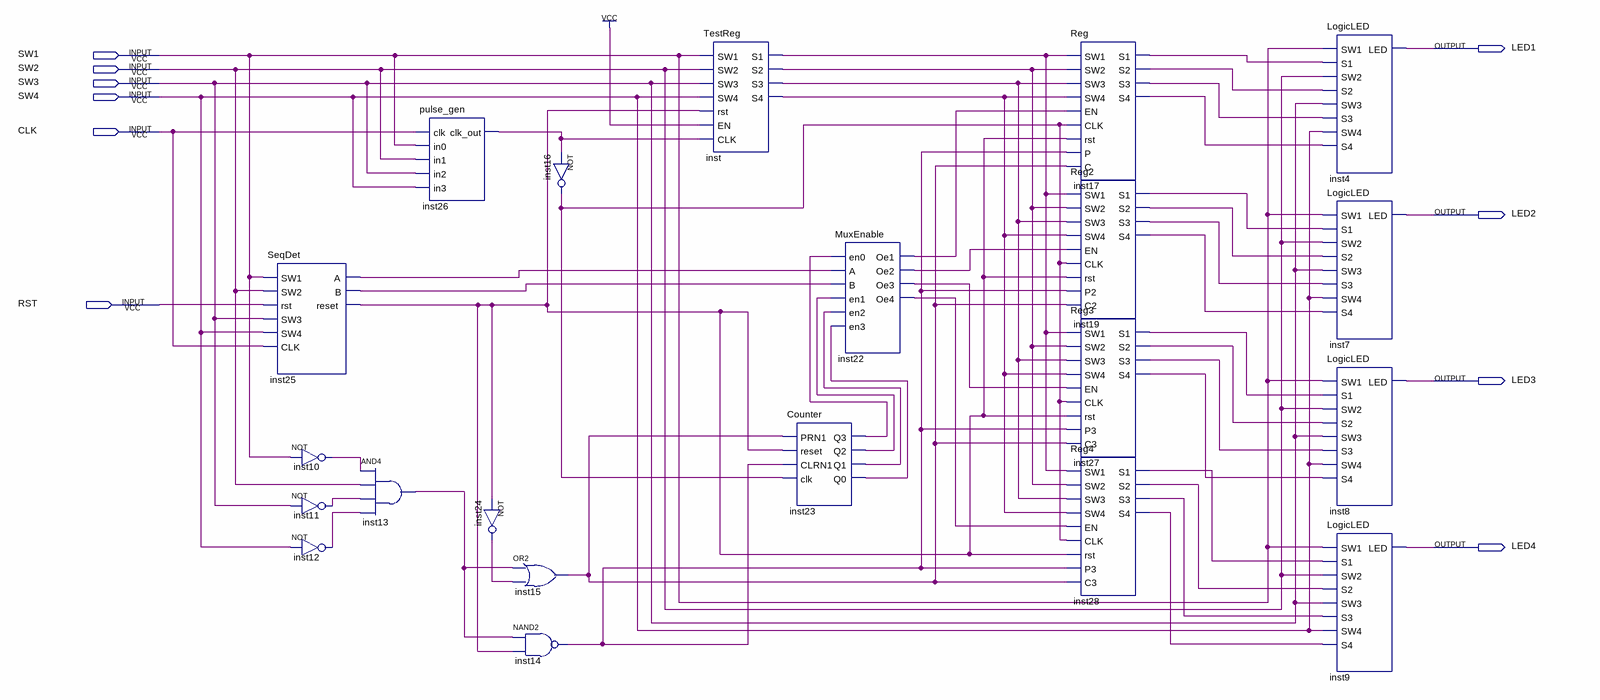
[diagram p0: schematic sheet]
// Quartus schematic Project.bdf as structural Verilog: 21 symbols, 10 pins
module Project (
  input  SW1,
  input  SW2,
  input  SW3,
  input  SW4,
  input  CLK,
  input  RST,
  output LED1,
  output LED2,
  output LED3,
  output LED4
);

  wire inst10_out, inst11_out, inst12_out, inst13_out, inst14_out, inst15_out, inst16_out, inst17_s1,
       inst17_s2, inst17_s3, inst17_s4, inst19_s1, inst19_s2, inst19_s3, inst19_s4, inst22_oe1, inst22_oe2,
       inst22_oe3, inst22_oe4, inst23_q0, inst23_q1, inst23_q2, inst23_q3, inst24_out, inst25_a, inst25_b,
       inst25_reset, inst26_clk_out, inst27_s1, inst27_s2, inst27_s3, inst27_s4, inst28_s1, inst28_s2,
       inst28_s3, inst28_s4, inst_s1, inst_s2, inst_s3, inst_s4;

  SeqDet inst25 (
    .SW1(SW1), .SW2(SW2), .rst(RST), .SW3(SW3), .SW4(SW4), .CLK(CLK), .A(inst25_a), .B(inst25_b),
    .reset(inst25_reset));
  not inst10 (inst10_out, SW1);
  not inst11 (inst11_out, SW3);
  not inst12 (inst12_out, SW4);
  and inst13 (inst13_out, inst10_out, SW2, inst11_out, inst12_out);
  pulse_gen inst26 (.clk(CLK), .in0(SW1), .in1(SW2), .in2(SW3), .in3(SW4), .clk_out(inst26_clk_out));
  not inst24 (inst24_out, inst25_reset);
  not inst16 (inst16_out, inst26_clk_out);
  or inst15 (inst15_out, inst13_out, inst24_out);
  nand inst14 (inst14_out, inst13_out, inst25_reset);
  TestReg inst (
    .SW1(SW1), .SW2(SW2), .SW3(SW3), .SW4(SW4), .rst(inst25_reset), .EN(1'b1), .CLK(inst26_clk_out),
    .S1(inst_s1), .S2(inst_s2), .S3(inst_s3), .S4(inst_s4));
  Counter inst23 (
    .PRN1(inst15_out), .reset(inst25_reset), .CLRN1(inst14_out), .clk(inst16_out), .Q3(inst23_q3),
    .Q2(inst23_q2), .Q1(inst23_q1), .Q0(inst23_q0));
  MuxEnable inst22 (
    .en0(inst23_q3), .A(inst25_a), .B(inst25_b), .en1(inst23_q2), .en2(inst23_q1), .en3(inst23_q0),
    .Oe1(inst22_oe1), .Oe2(inst22_oe2), .Oe3(inst22_oe3), .Oe4(inst22_oe4));
  Reg inst17 (
    .SW1(inst_s1), .SW2(inst_s2), .SW3(inst_s3), .SW4(inst_s4), .EN(inst22_oe1), .CLK(inst16_out),
    .rst(inst25_reset), .P(inst14_out), .C(inst15_out), .S1(inst17_s1), .S2(inst17_s2), .S3(inst17_s3),
    .S4(inst17_s4));
  Reg2 inst19 (
    .SW1(inst_s1), .SW2(inst_s2), .SW3(inst_s3), .SW4(inst_s4), .EN(inst22_oe2), .CLK(inst16_out),
    .rst(inst25_reset), .P2(inst14_out), .C2(inst15_out), .S1(inst19_s1), .S2(inst19_s2), .S3(inst19_s3),
    .S4(inst19_s4));
  Reg3 inst27 (
    .SW1(inst_s1), .SW2(inst_s2), .SW3(inst_s3), .SW4(inst_s4), .EN(inst22_oe3), .CLK(inst16_out),
    .rst(inst25_reset), .P3(inst14_out), .C3(inst15_out), .S1(inst27_s1), .S2(inst27_s2), .S3(inst27_s3),
    .S4(inst27_s4));
  Reg4 inst28 (
    .SW1(inst_s1), .SW2(inst_s2), .SW3(inst_s3), .SW4(inst_s4), .EN(inst22_oe4), .CLK(inst16_out),
    .rst(inst25_reset), .P3(inst14_out), .C3(inst15_out), .S1(inst28_s1), .S2(inst28_s2), .S3(inst28_s3),
    .S4(inst28_s4));
  LogicLED inst4 (
    .SW1(SW1), .S1(inst17_s1), .SW2(SW2), .S2(inst17_s2), .SW3(SW3), .S3(inst17_s3), .SW4(SW4),
    .S4(inst17_s4), .LED(LED1));
  LogicLED inst7 (
    .SW1(SW1), .S1(inst19_s1), .SW2(SW2), .S2(inst19_s2), .SW3(SW3), .S3(inst19_s3), .SW4(SW4),
    .S4(inst19_s4), .LED(LED2));
  LogicLED inst8 (
    .SW1(SW1), .S1(inst27_s1), .SW2(SW2), .S2(inst27_s2), .SW3(SW3), .S3(inst27_s3), .SW4(SW4),
    .S4(inst27_s4), .LED(LED3));
  LogicLED inst9 (
    .SW1(SW1), .S1(inst28_s1), .SW2(SW2), .S2(inst28_s2), .SW3(SW3), .S3(inst28_s3), .SW4(SW4),
    .S4(inst28_s4), .LED(LED4));
endmodule
